# EAGLE design SterownikOswietlenia (EAGLE 7.6.0)
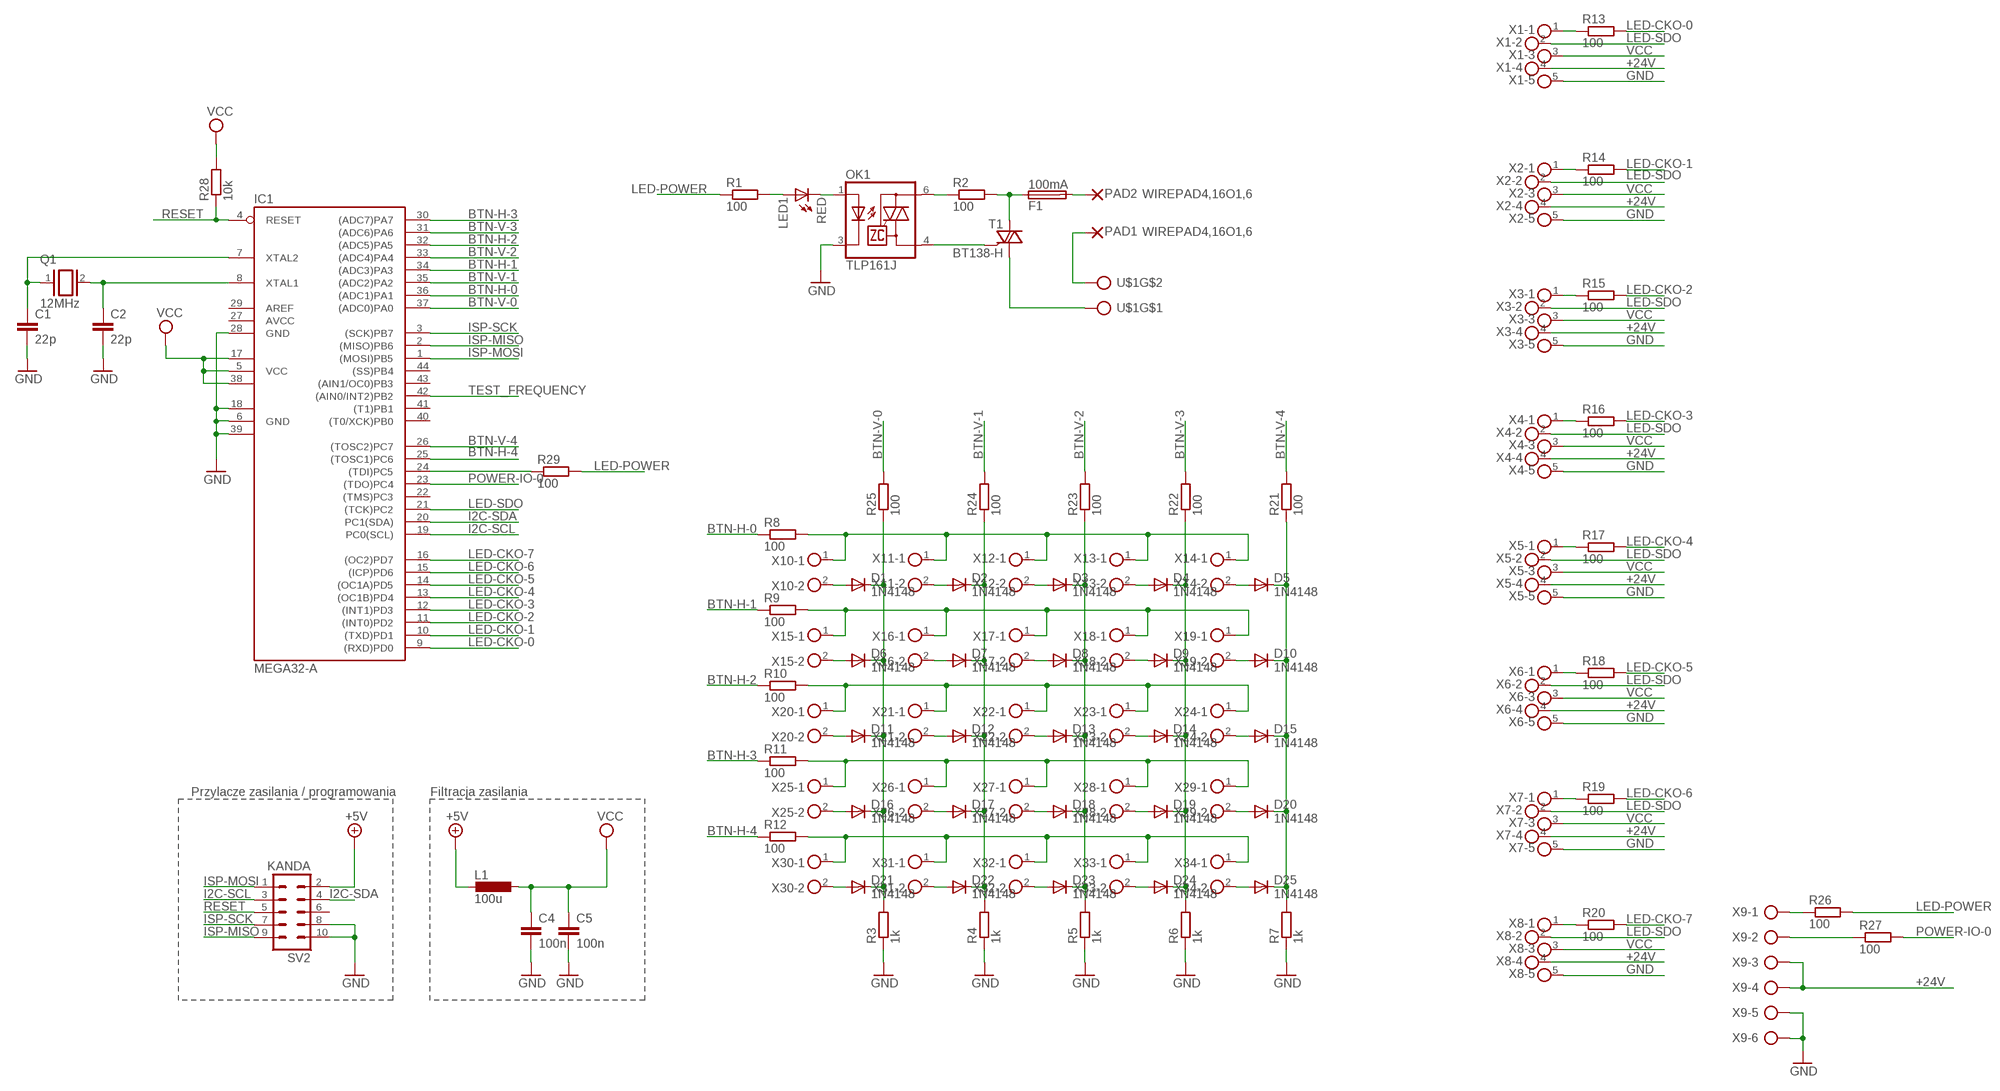
[diagram p0: schematic, sheet 1]

## Parts
C1  22p  C-EUC1206  [C1206]
C2  22p  C-EUC1206  [C1206]
C4  100n  C-EUC1206  [C1206]
C5  100n  C-EUC1206  [C1206]
D1  1N4148  DIODE-MINIMELF  [MINIMELF]
D2  1N4148  DIODE-MINIMELF  [MINIMELF]
D3  1N4148  DIODE-MINIMELF  [MINIMELF]
D4  1N4148  DIODE-MINIMELF  [MINIMELF]
D5  1N4148  DIODE-MINIMELF  [MINIMELF]
D6  1N4148  DIODE-MINIMELF  [MINIMELF]
D7  1N4148  DIODE-MINIMELF  [MINIMELF]
D8  1N4148  DIODE-MINIMELF  [MINIMELF]
D9  1N4148  DIODE-MINIMELF  [MINIMELF]
D10  1N4148  DIODE-MINIMELF  [MINIMELF]
D11  1N4148  DIODE-MINIMELF  [MINIMELF]
D12  1N4148  DIODE-MINIMELF  [MINIMELF]
D13  1N4148  DIODE-MINIMELF  [MINIMELF]
D14  1N4148  DIODE-MINIMELF  [MINIMELF]
D15  1N4148  DIODE-MINIMELF  [MINIMELF]
D16  1N4148  DIODE-MINIMELF  [MINIMELF]
D17  1N4148  DIODE-MINIMELF  [MINIMELF]
D18  1N4148  DIODE-MINIMELF  [MINIMELF]
D19  1N4148  DIODE-MINIMELF  [MINIMELF]
D20  1N4148  DIODE-MINIMELF  [MINIMELF]
D21  1N4148  DIODE-MINIMELF  [MINIMELF]
D22  1N4148  DIODE-MINIMELF  [MINIMELF]
D23  1N4148  DIODE-MINIMELF  [MINIMELF]
D24  1N4148  DIODE-MINIMELF  [MINIMELF]
D25  1N4148  DIODE-MINIMELF  [MINIMELF]
F1  100mA  F457  [F457]
IC1  MEGA32-A  [TQFP44]
L1  100u  L-EUL1210  [R1210]
LED1  RED  LED3MM  [LED3MM]
OK1  TLP161J  [MFP4]
PAD1  WIREPAD4,16O1,6  [4,16O1,6]
PAD2  WIREPAD4,16O1,6  [4,16O1,6]
Q1  12MHz  XTAL/S  [QS]
R1  100  R-EU_R1206  [R1206]
R2  100  R-EU_R1206  [R1206]
R3  1k  R-EU_R1206  [R1206]
R4  1k  R-EU_R1206  [R1206]
R5  1k  R-EU_R1206  [R1206]
R6  1k  R-EU_R1206  [R1206]
R7  1k  R-EU_R1206  [R1206]
R8  100  R-EU_R1206  [R1206]
R9  100  R-EU_R1206  [R1206]
R10  100  R-EU_R1206  [R1206]
R11  100  R-EU_R1206  [R1206]
R12  100  R-EU_R1206  [R1206]
R13  100  R-EU_R1206  [R1206]
R14  100  R-EU_R1206  [R1206]
R15  100  R-EU_R1206  [R1206]
R16  100  R-EU_R1206  [R1206]
R17  100  R-EU_R1206  [R1206]
R18  100  R-EU_R1206  [R1206]
R19  100  R-EU_R1206  [R1206]
R20  100  R-EU_R1206  [R1206]
R21  100  R-EU_R1206  [R1206]
R22  100  R-EU_R1206  [R1206]
R23  100  R-EU_R1206  [R1206]
R24  100  R-EU_R1206  [R1206]
R25  100  R-EU_R1206  [R1206]
R26  100  R-EU_R1206  [R1206]
R27  100  R-EU_R1206  [R1206]
R28  10k  R-EU_R1206  [R1206]
R29  100  R-EU_R1206  [R1206]
SV2  KANDA  ML10L  [ML10L]
T1  BT138-H  [TO220BH]
U$1  AK3001-2  [AK3001-2]
X1  AKL59-05  [5POL35]
X2  AKL59-05  [5POL35]
X3  AKL59-05  [5POL35]
X4  AKL59-05  [5POL35]
X5  AKL59-05  [5POL35]
X6  AKL59-05  [5POL35]
X7  AKL59-05  [5POL35]
X8  AKL59-05  [5POL35]
X9  AK500/6  [AK500/6]
X10  AKL59-02  [2POL35]
X11  AKL59-02  [2POL35]
X12  AKL59-02  [2POL35]
X13  AKL59-02  [2POL35]
X14  AKL59-02  [2POL35]
X15  AKL59-02  [2POL35]
X16  AKL59-02  [2POL35]
X17  AKL59-02  [2POL35]
X18  AKL59-02  [2POL35]
X19  AKL59-02  [2POL35]
X20  AKL59-02  [2POL35]
X21  AKL59-02  [2POL35]
X22  AKL59-02  [2POL35]
X23  AKL59-02  [2POL35]
X24  AKL59-02  [2POL35]
X25  AKL59-02  [2POL35]
X26  AKL59-02  [2POL35]
X27  AKL59-02  [2POL35]
X28  AKL59-02  [2POL35]
X29  AKL59-02  [2POL35]
X30  AKL59-02  [2POL35]
X31  AKL59-02  [2POL35]
X32  AKL59-02  [2POL35]
X33  AKL59-02  [2POL35]
X34  AKL59-02  [2POL35]

## Nets
+5V: L1.2 SV2.2
+24V: X1.4 X2.4 X3.4 X4.4 X5.4 X6.4 X7.4 X8.4 X9.3 X9.4
BTN-H-0: IC1.36((ADC1)PA1) R8.1
BTN-H-1: IC1.34((ADC3)PA3) R9.1
BTN-H-2: IC1.32((ADC5)PA5) R10.1
BTN-H-3: IC1.30((ADC7)PA7) R11.1
BTN-H-4: IC1.25((TOSC1)PC6) R12.1
BTN-V-0: IC1.37((ADC0)PA0) R25.2
BTN-V-1: IC1.35((ADC2)PA2) R24.2
BTN-V-2: IC1.33((ADC4)PA4) R23.2
BTN-V-3: IC1.31((ADC6)PA6) R22.2
BTN-V-4: IC1.26((TOSC2)PC7) R21.2
GND: C1.2 C2.2 C4.2 C5.2 IC1.6(GND) IC1.18(GND1) IC1.28(GND) IC1.39(GND2) OK1.3(C) R3.1 R4.1 R5.1 R6.1 R7.1 SV2.8 SV2.10 X1.5 X2.5 X3.5 X4.5 X5.5 X6.5 X7.5 X8.5 X9.5 X9.6
I2C-SCL: IC1.19(PC0(SCL)) SV2.3
I2C-SDA: IC1.20(PC1(SDA)) SV2.4
ISP-MISO: IC1.2((MISO)PB6) SV2.9
ISP-MOSI: IC1.1((MOSI)PB5) SV2.1
ISP-SCK: IC1.3((SCK)PB7) SV2.7
LED-CKO-0: IC1.9((RXD)PD0) R13.2
LED-CKO-1: IC1.10((TXD)PD1) R14.2
LED-CKO-2: IC1.11((INT0)PD2) R15.2
LED-CKO-3: IC1.12((INT1)PD3) R16.2
LED-CKO-4: IC1.13((OC1B)PD4) R17.2
LED-CKO-5: IC1.14((OC1A)PD5) R18.2
LED-CKO-6: IC1.15((ICP)PD6) R19.2
LED-CKO-7: IC1.16((OC2)PD7) R20.2
LED-POWER: R1.1 R26.2 R29.2
LED-SDO: IC1.21((TCK)PC2) X1.2 X2.2 X3.2 X4.2 X5.2 X6.2 X7.2 X8.2
M$44: R12.2 X30.1 X31.1 X32.1 X33.1 X34.1
N$1: PAD1.1(P) U$1.P$3 U$1.P$4
N$2: OK1.6(A2) R2.1
N$3: F1.1 R2.2 T1.T2(A2)
N$4: OK1.4(A1) T1.G
N$5: LED1.K(C) OK1.1(A)
N$6: LED1.A R1.2
N$7: R13.1 X1.1
N$8: T1.T1(A1) U$1.P$1 U$1.P$2
N$9: D1.A X10.2
N$10: D2.A X11.2
N$11: F1.2 PAD2.1(P)
N$12: D3.A X12.2
N$13: D4.A X13.2
N$14: R14.1 X2.1
N$15: R15.1 X3.1
N$16: R16.1 X4.1
N$17: R17.1 X5.1
N$18: D5.A X14.2
N$19: D10.A X19.2
N$20: D9.A X18.2
N$21: D8.A X17.2
N$22: D7.A X16.2
N$23: D6.A X15.2
N$24: D11.A X20.2
N$25: D12.A X21.2
N$26: D13.A X22.2
N$27: D14.A X23.2
N$28: D15.A X24.2
N$29: D20.A X29.2
N$30: D19.A X28.2
N$32: D17.A X26.2
N$33: D16.A X25.2
N$34: D21.A X30.2
N$35: D22.A X31.2
N$36: D23.A X32.2
N$37: D24.A X33.2
N$38: D25.A X34.2
N$39: R18.1 X6.1
N$40: R8.2 X10.1 X11.1 X12.1 X13.1 X14.1
N$41: R9.2 X15.1 X16.1 X17.1 X18.1 X19.1
N$42: R10.2 X20.1 X21.1 X22.1 X23.1 X24.1
N$43: R11.2 X25.1 X26.1 X27.1 X28.1 X29.1
N$44: R19.1 X7.1
N$45: R20.1 X8.1
N$46: C1.1 IC1.7(XTAL2) Q1.1
N$47: C2.1 IC1.8(XTAL1) Q1.2
N$49: R27.1 X9.2
N$50: R26.1 X9.1
N$51: IC1.24((TDI)PC5) R29.1
N$52: D18.A X27.2
N$113: D5.C D10.C D15.C D20.C D25.C R7.2 R21.1
N$131: D4.C D9.C D14.C D19.C D24.C R6.2 R22.1
N$132: D3.C D8.C D13.C D18.C D23.C R5.2 R23.1
N$133: D2.C D7.C D12.C D17.C D22.C R4.2 R24.1
N$134: D1.C D6.C D11.C D16.C D21.C R3.2 R25.1
POWER-IO-0: IC1.23((TDO)PC4) R27.2
RESET: IC1.4(RESET) R28.1 SV2.5
TEST_FREQUENCY: IC1.42((AIN0/INT2)PB2)
VCC: C4.1 C5.1 IC1.5(VCC) IC1.17(VCC1) IC1.38(VCC2) L1.1 R28.2 X1.3 X2.3 X3.3 X4.3 X5.3 X6.3 X7.3 X8.3
Unconnected: IC1.22((TMS)PC3) IC1.29(AREF) IC1.40((T0/XCK)PB0) IC1.41((T1)PB1) IC1.43((AIN1/OC0)PB3) IC1.44((SS)PB4) SV2.6

## Notes on the sheet
- Przylacze zasilania / programowania | Filtracja zasilania

## Power pins joined to a net without a drawn wire
AVCC: IC1.27(AVCC)

## Library data of the parts
C1 C2 C4 C5 = rcl:C-EU: CAPACITOR, European symbol
D1-D25 = diode:DIODE-: DIODE
F1 = fuse:F457: FUSE HOLDER CS, Schukat; OC_FARNELL: unknown; OC_NEWARK: unknown
IC1 = atmel:MEGA32: MICROCONTROLLER 32 Kbytes FLASH 2 Kbytes SRAM 1 Kbytes EEPROM USART 8-channel 10 bit ADC Source: www.atmel.com .. doc2503.pdf; MPN: ATMEGA32-16AU; OC_FARNELL: 9171274; OC_NEWARK: 69K6677
L1 = rcl:L-EU: INDUCTOR, European symbol
LED1 = led:LED: LED OSRAM: - CHIPLED LG R971, LG N971, LY N971, LG Q971, LY Q971, LO R971, LY R971 LH N974, LH R974 LS Q976, LO Q976, LY Q976 LO Q996 - Hyper CHIPLED LW Q18S LB Q993, LB Q99A, LB R99A - SideLED LS A670, LO A670, LY A670, LG A670, LP A670 LB A673, LV A673, LT A673, LW A673 LH A674 LY A675 LS A676, LA A676, LO A676, LY A676, LW A676 LS A679, LY A679, LG A679 - Hyper Micro SIDELED® LS Y876, LA Y876, LO Y876, LY Y876 LT Y87S - SmartLED LW L88C, LW L88S LB L89C, LB L89S, LG L890 LS L89K, LO L89K, LY L89K LS L896, LA L896, LO L896, LY L896 - TOPLED LS T670, LO T670, LY T670, LG T670, LP T670 LSG T670, LSP T670, LSY T670, LOP T670, LYG T670 LG T671, LOG T671, LSG T671 LB T673, LV T673, LT T673, LW T673 LH T674 LS T676, LA T676, LO T676, LY T676, LB T676, LH T676, LSB T676, LW T676 LB T67C, LV T67C, LT T67C, LS T67K, LO T67K, LY T67K, LW E67C LS E67B, LA E67B, LO E67B, LY E67B, LB E67C, LV E67C, LT E67C LW T67C LS T679, LY T679, LG T679 LS T770, LO T770, LY T770, LG T770, LP T770 LB T773, LV T773, LT T773, LW T773 LH T774 LS E675, LA E675, LY E675, LS T675 LS T776, LA T776, LO T776, LY T776, LB T776 LHGB T686 LT T68C, LB T68C - Hyper Mini TOPLED® LB M676 - Mini TOPLED Santana® LG M470 LS M47K, LO M47K, LY M47K Source: http://www.osram.convergy.de LUXEON: - LUMILED® LXK2-PW12-R00, LXK2-PW12-S00, LXK2-PW14-U00, LXK2-PW14-V00 LXK2-PM12-R00, LXK2-PM12-S00, LXK2-PM14-U00 LXK2-PE12-Q00, LXK2-PE12-R00, LXK2-PE12-S00, LXK2-PE14-T00, LXK2-PE14-U00 LXK2-PB12-K00, LXK2-PB12-L00, LXK2-PB12-M00, LXK2-PB14-N00, LXK2-PB14-P00, LXK2-PB14-Q00 LXK2-PR12-L00, LXK2-PR12-M00, LXK2-PR14-Q00, LXK2-PR14-R00 LXK2-PD12-Q00, LXK2-PD12-R00, LXK2-PD12-S00 LXK2-PH12-R00, LXK2-PH12-S00 LXK2-PL12-P00, LXK2-PL12-Q00, LXK2-PL12-R00 Source: www.luxeon.com KINGBRIGHT: KA-3528ASYC Source: www.kingbright.com
OK1 = RD:TLP161J: Optotriak SMD 2.5kV 600V 10mA MFP4 przełączanie w zerze PBF Source: http://mselektronik.pl/attchmentdownload/download/download/?d=0&file=custom%2Fupload%2FFile-1350758070.pdf
PAD1 PAD2 = wirepad:WIREPAD: Wire PAD connect wire on PCB
Q1 = special:XTAL/S: CRYSTAL
R1-R29 = rcl:R-EU_: RESISTOR, European symbol
SV2 = con-harting-ml:ML10: HARTING; OC_FARNELL: unknown; OC_NEWARK: unknown
T1 = triac:BT138: TRIAC Source: http://www.semiconductors.philips.com BT138_SERIES_2.pdf
U$1 = RD:AK3001-2
X1-X8 = con-ria-59:AKL59-05: RIA Anschlussklemme Typ 59, Raster 3,5 mm, Polzahl 5
X9 = con-ptr500:AK500/6: CONNECTOR; OC_FARNELL: unknown; OC_NEWARK: unknown
X10-X34 = con-ria-59:AKL59-02: RIA Anschlussklemme Typ 59, Raster 3,5 mm, Polzahl 2

## Net classes
0 default: clearance 0.355 mm

## Board
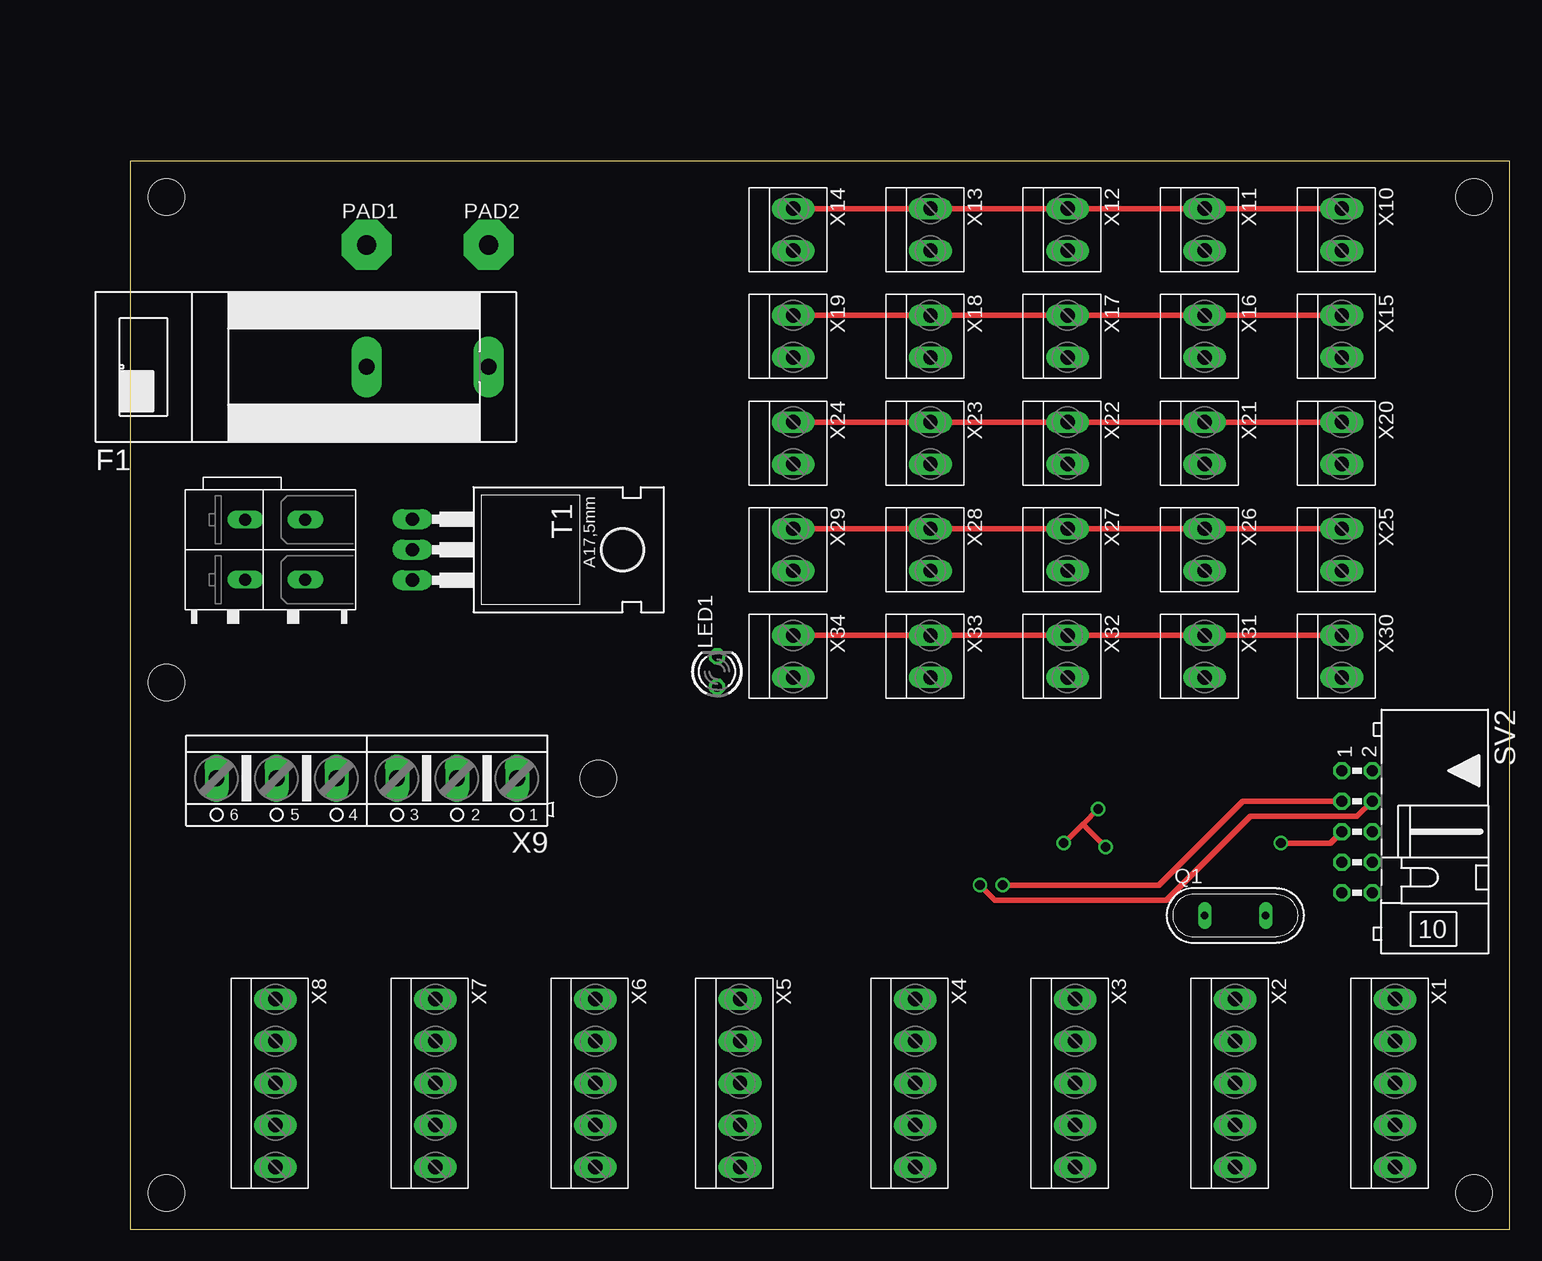
[diagram p1: board, top side]
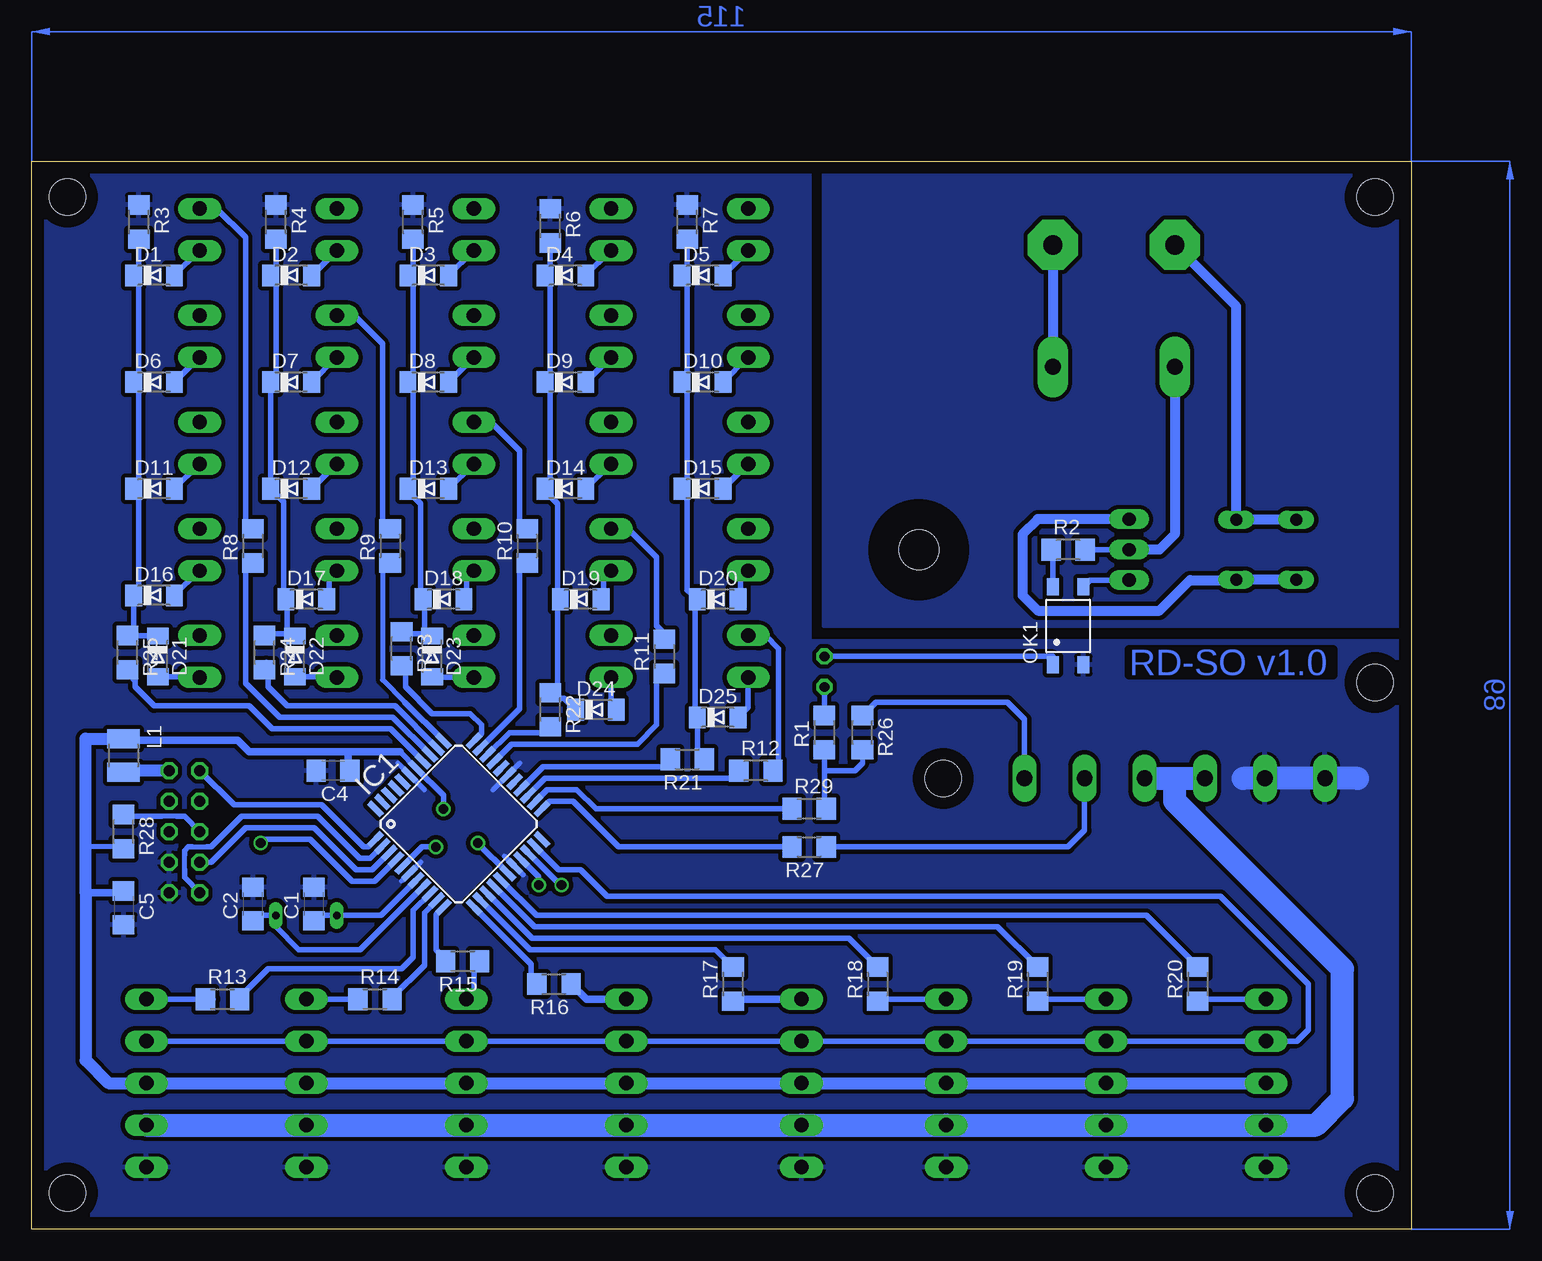
[diagram p2: board, bottom side, seen from below]

Size 115 x 89 mm. Coordinates in mm from the lower left corner, seen from the top.
Outline: 0,0 115,0 115,89 0,89 0,0
Copper layers (1*16): Top 0.035mm / dielectric 1.5mm / Bottom 0.035mm
Design rules "default *": minimum track width 10mil, minimum drill 24mil, track to track 8mil, track to pad 8mil, pad to pad 8mil, via to via 8mil, smd to smd 8mil, copper to edge 40mil, drill to drill 8mil, minimum pad ring 10mil, minimum via ring 8mil, stop-mask expansion 4mil, vias tented up to drill 0mil, thermal gap 10mil
Holes 3 mm at 3,3 3,86 112,86 112,3 3,45.54 39,37.54

### Footprints (pad centres in the part's own frame; a part is rotated, then mirrored left to right if it is on the bottom)
C1206 = smd 1.6 x 1.8: 1 -1.4,0; 2 1.4,0
MINIMELF = smd 1.4 x 1.8: A 1.7,0; C -1.7,0
F457 = drill 1.321 pad 2.54 long: 1 -5.08,0; 2 5.08,0
TQFP44 = smd 1.5 x 0.5: 1 -5.8,4; 2 -5.8,3.2; 3 -5.8,2.4; 4 -5.8,1.6; 5 -5.8,0.8; 6 -5.8,0; 7 -5.8,-0.8; 8 -5.8,-1.6; 9 -5.8,-2.4; 10 -5.8,-3.2; 11 -5.8,-4; 23 5.8,-4; 24 5.8,-3.2; 25 5.8,-2.4; 26 5.8,-1.6; 27 5.8,-0.8; 28 5.8,0; 29 5.8,0.8; 30 5.8,1.6; 31 5.8,2.4; 32 5.8,3.2; 33 5.8,4 | smd 0.5 x 1.5: 12 -4,-5.8; 13 -3.2,-5.8; 14 -2.4,-5.8; 15 -1.6,-5.8; 16 -0.8,-5.8; 17 0,-5.8; 18 0.8,-5.8; 19 1.6,-5.8; 20 2.4,-5.8; 21 3.2,-5.8; 22 4,-5.8; 34 4,5.8; 35 3.2,5.8; 36 2.4,5.8; 37 1.6,5.8; 38 0.8,5.8; 39 0,5.8; 40 -0.8,5.8; 41 -1.6,5.8; 42 -2.4,5.8; 43 -3.2,5.8; 44 -4,5.8
R1210 = smd 1.6 x 2.7: 1 -1.4,0; 2 1.4,0
LED3MM = drill 0.813 octagon: A -1.27,0; K 1.27,0
MFP4 = smd 1.016 x 1.422: 1 -1.27,-3.25; 3 1.27,-3.25; 4 1.27,3.25; 6 -1.27,3.25
4,16O1,6 = drill 1.6 pad 4.166 octagon: 1 0,0
QS = drill 0.61 long: 1 -2.54,0; 2 2.54,0
R1206 = smd 1.6 x 1.803: 1 -1.422,0; 2 1.422,0
ML10L = drill 0.914 octagon: 1 -5.08,-1.27; 2 -5.08,1.27; 3 -2.54,-1.27; 4 -2.54,1.27; 5 0,-1.27; 6 0,1.27; 7 2.54,-1.27; 8 2.54,1.27; 9 5.08,-1.27; 10 5.08,1.27
TO220BH = drill 1.118 long: G 2.54,-6.35; T1 -2.54,-6.35; T2 0,-6.35 | hole 3.302: 0,11.176
AK3001-2 = drill 1 long: P$1 -2.5,2.5; P$2 -2.5,-2.5; P$3 2.5,2.5; P$4 2.5,-2.5
5POL35 = drill 1.2 long: 1 -7,0; 2 -3.5,0; 3 0,0; 4 3.5,0; 5 7,0
AK500/6 = drill 1.321 long: 1 -12.522,0; 2 -7.518,0; 3 -2.515,0; 4 2.515,0; 5 7.518,0; 6 12.522,0
2POL35 = drill 1.2 long: 1 -1.75,0; 2 1.75,0

### Placement (x,y rotation side)
C1  91.45,27.08 90 bottom
C2  96.53,27.08 90 bottom
C4  89.87,38.2 180 bottom
C5  107.33,26.77 270 bottom
D1  104.79,79.47 0 bottom
D2  93.36,79.47 0 bottom
D3  81.93,79.47 0 bottom
D4  70.5,79.47 0 bottom
D5  59.07,79.47 0 bottom
D6  104.79,70.58 0 bottom
D7  93.36,70.58 0 bottom
D8  81.93,70.58 0 bottom
D9  70.5,70.58 0 bottom
D10  59.07,70.58 0 bottom
D11  104.79,61.69 0 bottom
D12  93.36,61.69 0 bottom
D13  81.93,61.69 0 bottom
D14  70.5,61.69 0 bottom
D15  59.07,61.69 0 bottom
D16  104.79,52.8 0 bottom
D17  92.09,52.48 0 bottom
D18  80.66,52.48 0 bottom
D19  69.23,52.48 0 bottom
D20  57.8,52.48 0 bottom
D21  104.47,47.72 270 bottom
D22  93.04,47.72 270 bottom
D23  81.61,47.72 270 bottom
D24  67.96,43.27 0 bottom
D25  57.8,42.64 0 bottom
F1  24.78,71.85 0 top
IC1  79.39,33.75 45 bottom
L1  107.33,39.46 270 bottom
LED1  48.91,46.45 90 top
OK1  28.59,50.26 0 bottom
PAD1  19.7,82.01 0 top
PAD2  29.86,82.01 0 top
Q1  92.09,26.13 0 top
R1  48.91,41.37 90 bottom
R2  28.59,56.61 0 bottom
R3  106.06,83.92 270 bottom
R4  94.63,83.92 270 bottom
R5  83.2,83.92 270 bottom
R6  71.77,83.6 270 bottom
R7  60.34,83.92 270 bottom
R8  96.53,56.93 90 bottom
R9  85.11,56.93 90 bottom
R10  73.67,56.93 90 bottom
R11  62.24,47.72 90 bottom
R12  54.62,38.2 0 bottom
R13  99.08,19.14 0 bottom
R14  86.38,19.14 0 bottom
R15  79.07,22.32 180 bottom
R16  71.45,20.41 180 bottom
R17  56.53,20.41 90 bottom
R18  44.47,20.41 90 bottom
R19  31.13,20.41 90 bottom
R20  17.8,20.41 90 bottom
R21  60.34,39.15 180 bottom
R22  71.77,43.27 270 bottom
R23  84.15,48.35 270 bottom
R24  95.58,48.04 270 bottom
R25  107.01,48.04 270 bottom
R26  45.73,41.37 270 bottom
R27  50.18,31.84 180 bottom
R28  107.33,33.12 270 bottom
R29  50.18,35.02 0 bottom
SV2  102.25,33.12 270 top
T1  29.86,56.61 270 top
U$1  12.08,56.61 90 top
X1  105.42,12.16 270 top
X2  92.09,12.16 270 top
X3  78.75,12.16 270 top
X4  65.42,12.16 270 top
X5  50.81,12.16 270 top
X6  38.75,12.16 270 top
X7  25.41,12.16 270 top
X8  12.08,12.16 270 top
X9  19.7,37.56 180 top
X10  100.98,83.28 270 top
X11  89.55,83.28 270 top
X12  78.12,83.28 270 top
X13  66.69,83.28 270 top
X14  55.26,83.28 270 top
X15  100.98,74.39 270 top
X16  89.55,74.39 270 top
X17  78.12,74.39 270 top
X18  66.69,74.39 270 top
X19  55.26,74.39 270 top
X20  100.98,65.5 270 top
X21  89.55,65.5 270 top
X22  78.12,65.5 270 top
X23  66.69,65.5 270 top
X24  55.26,65.5 270 top
X25  100.98,56.61 270 top
X26  89.55,56.61 270 top
X27  78.12,56.61 270 top
X28  66.69,56.61 270 top
X29  55.26,56.61 270 top
X30  100.98,47.72 270 top
X31  89.55,47.72 270 top
X32  78.12,47.72 270 top
X33  66.69,47.72 270 top
X34  55.26,47.72 270 top

### Tracks (layer width: path | path; a pad name or v marks a point on that pad's centre or on a via)
+5V
  Bottom 0.61: 107.2,38.2 L1.2
  Bottom 1.016: SV2.2 107.2,38.2
+24V
  Bottom 1.93: X1.4 X2.4 X3.4 X4.4 X5.4 X6.4 X7.4 X8.4 7.96,8.66 5.73,10.89 5.73,21.68 19.7,35.66 19.7,37.56 | X9.3 19.7,37.56 | 19.7,37.56 X9.4
BTN-H-0
  Bottom 0.406: R8.1 97.02,55.02 97.17,55.02
  Bottom 0.457: IC1.36 84.89,42.64 94.31,42.64 97.17,45.5 97.17,55.02
BTN-H-1
  Bottom 0.406: 85.74,55.34 85.74,45.76 83.89,43.91
  Bottom 0.457: IC1.34 83.89,43.91 | 85.74,55.34 85.58,55.51 R9.1
BTN-H-2
  Bottom 0.457: IC1.32 74.31,43.35 74.31,55.34 73.83,55.82 R10.1
BTN-H-3
  Bottom 0.457: IC1.30 74.98,40.42 64.47,40.42 62.88,42.01 62.88,46.45 62.73,46.45 R11.1
BTN-H-4
  Bottom 0.457: IC1.25 72.19,37.56 56.53,37.56 56.53,37.71 R12.1
BTN-V-0
  Bottom 0.406: R25.2 106.53,45.81 106.38,45.81
  Bottom 0.457: IC1.37 85.06,41.69 94.95,41.69 96.85,43.59 104.79,43.59 106.38,45.18 106.38,45.81
BTN-V-1
  Bottom 0.406: R24.2 95.43,47.25 95.27,47.09
  Bottom 0.457: IC1.35 84.71,43.59 93.68,43.59 95.27,45.18 95.27,47.09
BTN-V-2
  Bottom 0.457: R23.2 83.83,47.25 83.83,45.18 81.61,42.96 78.44,42.96 77.48,42.01 77.48,41.31 IC1.33
BTN-V-3
  Bottom 0.457: IC1.31 75.16,41.37 72.09,41.37 71.77,41.69 R22.2
BTN-V-4
  Bottom 0.457: IC1.26 72.36,38.51 62.4,38.51 R21.2
GND
  Bottom 0.406: 84.15,28.99 IC1.6 82.56,30.57 | 82.25,36.61 IC1.39 84.15,38.51 84.47,38.83 | 73.99,29.48 IC1.18 75.58,31.07 | 74.31,38.83 IC1.28 76.53,36.61
  Bottom 1.93: 4.46,37.56 13.98,37.56
  pour Bottom: -0.62,48.99 -1.54,-1.81 117.49,-1.81 114.95,89.63 50.18,89.63 50.18,48.99
I2C-SCL  (via drill 0.8)
  Top 0.457: v72.72,28.67 85.74,28.67 92.72,35.66 SV2.3
  Bottom 0.457: IC1.19 72.72,29.34 v72.72,28.67
I2C-SDA  (via drill 0.8)
  Top 0.406: 72.09,27.4 v70.82,28.67
  Top 0.457: 72.09,27.4 86.38,27.4 93.36,34.38 102.25,34.38 SV2.4
  Bottom 0.406: 70.82,28.57 v70.82,28.67
  Bottom 0.457: IC1.20 70.82,28.57
ISP-MISO
  Bottom 0.406: 102.25,29.94 102.25,31.21 | 101.61,31.84 100.34,31.84
  Bottom 0.457: IC1.2 86.77,30.89 87.64,30.89 91.14,34.38 97.49,34.38 100.03,31.84 100.34,31.84 | SV2.9 102.25,29.3 102.25,29.94 | 102.25,31.21 102.25,31.53 101.93,31.84 101.61,31.84
ISP-MOSI
  Bottom 0.457: SV2.1 98.12,35.34 90.82,35.34 87.33,31.84 86.95,31.84 IC1.1
ISP-SCK
  Bottom 0.457: IC1.3 86.59,29.94 87.96,29.94 91.45,33.43 97.17,33.43 100.03,30.57 SV2.7
LED-CKO-0
  Bottom 0.457: R13.2 97.02,19.93 95.27,21.68 84.15,21.68 83.2,22.64 83.2,26.55 IC1.9
LED-CKO-1
  Bottom 0.457: R14.2 84.95,19.3 82.25,22 82.25,26.37 IC1.10
LED-CKO-2
  Bottom 0.457: IC1.11 81.3,26.19 81.3,23.27 80.5,22.48 R15.2
LED-CKO-3
  Bottom 0.457: IC1.12 73.36,22.06 73.36,20.73 73.04,20.41 R16.2
LED-CKO-4
  Bottom 0.457: IC1.13 73.44,23.27 57.97,23.27 R17.2
LED-CKO-5
  Bottom 0.457: IC1.14 73.26,24.22 46.85,24.22 R18.2
LED-CKO-6
  Bottom 0.457: IC1.15 73.08,25.18 34.47,25.18 R19.2
LED-CKO-7
  Bottom 0.457: IC1.16 72.9,26.13 22.09,26.13 R20.2
LED-POWER
  Bottom 0.406: R26.2 45.73,38.83 | 48.91,35.17 R29.2
  Bottom 0.457: 48.91,38.2 46.37,38.2 45.73,38.83 | R1.1 48.91,38.2 | 48.91,38.2 48.91,35.17
LED-SDO
  Bottom 0.457: IC1.21 71.06,29.94 69.23,29.94 67.01,27.72 15.89,27.72 8.59,20.41 8.59,16.61 9.53,15.66 X8.2 X7.2 X6.2 X5.2 X4.2 X3.2 X2.2 X1.2
M$44
  Top 0.457: X30.1 X31.1 X32.1 X33.1 X34.1
  Bottom 0.457: R12.2 52.72,39 52.72,48.35 53.84,49.47 X34.1
N$1
  Bottom 0.813: U$1.P$3 U$1.P$4 14.58,76.89 PAD1.1
N$2
  Bottom 0.406: 29.86,56.46 R2.1
  Bottom 0.457: OK1.6 29.86,56.46
N$3
  Bottom 0.457: R2.2 T1.T2
  Bottom 0.813: F1.1 19.7,57.88 20.97,56.61 T1.T2
N$4
  Bottom 0.457: T1.G 26.76,54.07 OK1.4
N$5
  Bottom 0.457: OK1.1 29.86,47.72 LED1.K
N$6
  Bottom 0.457: R1.2 LED1.A
N$7
  Bottom 0.457: X1.1 99.85,19.16 R13.1
N$8
  Bottom 0.813: T1.T1 31.13,59.15 32.4,57.88 32.4,52.8 31.13,51.53 20.97,51.53 18.43,54.07 14.62,54.07 U$1.P$2 U$1.P$1
N$9
  Bottom 0.457: D1.A 101.03,81.53 X10.2
N$10
  Bottom 0.457: D2.A 91.61,79.47 X11.2
N$11
  Bottom 0.813: PAD2.1 F1.2
N$12
  Bottom 0.457: D3.A 78.17,81.53 X12.2
N$13
  Bottom 0.457: D4.A 66.74,81.53 X13.2
N$14
  Bottom 0.457: X2.1 87.81,19.16 R14.1
N$15
  Bottom 0.457: X3.1 78.12,19.78 78.12,21.85 R15.1
N$16
  Bottom 0.61: X4.1 68.75,19.16 R16.1
N$17
  Bottom 0.61: X5.1 56.36,19.16 R17.1
N$18
  Bottom 0.457: D5.A 55.31,81.53 X14.2
N$19
  Bottom 0.457: D10.A 55.31,72.64 X19.2
N$20
  Bottom 0.457: D9.A 66.74,72.64 X18.2
N$21
  Bottom 0.457: D8.A 78.17,72.64 X17.2
N$22
  Bottom 0.457: D7.A 89.6,72.64 X16.2
N$23
  Bottom 0.457: D6.A 101.03,72.64 X15.2
N$24
  Bottom 0.457: D11.A 101.03,63.75 X20.2
N$25
  Bottom 0.457: D12.A 89.6,63.75 X21.2
N$26
  Bottom 0.457: D13.A 78.17,63.75 X22.2
N$27
  Bottom 0.457: D14.A 66.74,63.75 X23.2
N$28
  Bottom 0.457: D15.A 55.31,63.75 X24.2
N$29
  Bottom 0.457: D20.A 55.9,52.69 55.9,54.23 X29.2
N$30
  Bottom 0.457: X28.2 67.33,54.23 67.33,52.69 D19.A
N$32
  Bottom 0.457: X26.2 89.71,54.86 90.19,54.39 90.19,52.69 D17.A
N$33
  Bottom 0.457: D16.A 101.03,54.86 X25.2
N$34
  Bottom 0.406: 101.03,46.02 X30.2
  Bottom 0.457: D21.A 101.03,46.02
N$35
  Bottom 0.406: 89.6,46.02 X31.2
  Bottom 0.457: D22.A 89.6,46.02
N$36
  Bottom 0.457: D23.A 81.88,45.97 X32.2
N$37
  Bottom 0.457: X33.2 66.69,43.07 D24.A
N$38
  Bottom 0.457: D25.A 55.26,43.48 X34.2
N$39
  Bottom 0.457: X6.1 44.3,19.16 R18.1
N$40
  Top 0.457: X14.1 X13.1 X12.1 X11.1 X10.1
  Bottom 0.406: R8.2 97.02,58.83 97.17,58.83
  Bottom 0.457: 97.17,58.83 97.17,82.65 99.56,85.03 X10.1
N$41
  Top 0.457: X19.1 X18.1 X17.1 X16.1 X15.1
  Bottom 0.457: R9.2 85.74,58.98 85.74,73.76 88.12,76.14 X16.1
N$42
  Top 0.457: X24.1 X23.1 X22.1 X21.1 X20.1
  Bottom 0.457: R10.2 74.16,58.83 74.31,58.83 74.31,64.87 76.69,67.25 X22.1
N$43
  Top 0.457: X25.1 X26.1 X27.1 X28.1 X29.1
  Bottom 0.457: X28.1 65.27,58.36 62.88,55.98 62.88,50.26 62.4,49.78 R11.2
N$44
  Bottom 0.457: X7.1 30.96,19.16 R19.1
N$45
  Bottom 0.457: X8.1 17.63,19.16 R20.1
N$46
  Bottom 0.457: C1.1 91.33,26.13 Q1.1 85.88,26.13 IC1.7
N$47
  Bottom 0.457: IC1.8 87.61,23.27 92.72,23.27 94.63,25.18 Q1.2 96.41,26.13 C2.1
N$48
  pour Bottom: -0.62,88.36 -0.62,50.26 48.91,50.26 48.91,88.36
N$49
  Bottom 0.457: R27.1 28.59,31.84 27.22,33.22 X9.2
N$50
  Bottom 0.457: R26.1 44.62,43.91 33.67,43.91 32.22,42.46 X9.1
N$51
  Bottom 0.457: IC1.24 72.01,36.61 69.55,36.61 67.96,35.02 R29.1
N$52
  Bottom 0.457: X27.2 78.75,54.23 78.75,52.69 D18.A
N$113
  Bottom 0.457: R21.1 59.5,39.73 D25.C 59.7,42.84 59.7,52.28 D20.C 60.34,53.23 60.34,61.26 D15.C 60.34,62.12 60.34,70.15 D10.C 60.34,71.01 60.34,79.04 D5.C 60.34,79.9 R7.2
N$131
  Bottom 0.457: R6.2 71.77,79.9 D4.C 71.77,79.04 71.77,71.01 D9.C 71.77,70.15 71.77,62.12 D14.C 72.2,61.48 71.14,60.42 71.14,52.69 D19.C 71.14,52.28 71.14,45.33 R22.1 71.77,44.23 70.61,44.23 D24.C
N$132
  Bottom 0.457: R5.2 83.2,79.9 D3.C 83.2,79.04 83.2,71.01 D8.C 83.2,70.15 83.2,62.12 D13.C 83.2,61.26 83.2,61.05 82.56,60.42 82.56,52.69 D18.C 82.25,52.37 82.25,49.62 | R23.1 83.67,49.62 82.25,49.62 | D23.C 81.82,49.62 82.25,49.62
N$133
  Bottom 0.457: R4.2 94.63,79.9 D2.C 94.63,79.04 94.63,71.01 D7.C D12.C 94,60.62 94,52.69 D17.C 93.68,52.37 93.68,49.62 | R24.1 95.1,49.62 93.68,49.62 | D22.C 93.25,49.62 93.68,49.62
N$134
  Bottom 0.406: 106.73,49.42 R25.1 106.49,49.66
  Bottom 0.457: D1.C 106.06,79.04 | 106.06,79.04 106.06,71.01 D6.C 106.06,70.15 106.06,62.12 D11.C 106.06,61.26 106.06,53.23 D16.C 106.49,49.66 | 106.06,79.04 R3.2 | D21.C 106.73,49.42
POWER-IO-0
  Bottom 0.457: R27.2 66.06,31.84 69.87,35.66 71.83,35.66 IC1.23
RESET  (via drill 0.8)
  Top 0.457: SV2.5 100.03,32.16 v95.9,32.16
  Bottom 0.406: 102.89,34.38 104.16,34.38 | 107.33,34.38 R28.1
  Bottom 0.457: IC1.4 86.42,28.99 88.28,28.99 91.77,32.48 95.58,32.48 v95.9,32.16 | SV2.5 102.25,34.38 102.89,34.38 | 104.16,34.38 107.33,34.38
VCC  (via drill 0.8)
  Top 0.406: v80.66,35.02 79.39,33.75 | 79.39,33.75 v77.8,32.16 | v77.8,32.16 | v81.3,31.84 79.39,33.75
  Bottom 0.406: 106.38,40.73 107.33,41.05 L1.1 | C4.1 88.6,38.64 | R28.2 107.97,31.69 107.97,31.84 110.5,31.84 | v77.8,32.16
  Bottom 0.457: 84.29,39.78 IC1.38 80.66,36.15 v80.66,35.02 | IC1.17 v77.8,32.16 | IC1.5 82.43,31.84 v81.3,31.84
  Bottom 0.61: 84.29,39.78 88.6,39.78 | 88.6,39.78 96.85,39.78 97.81,40.73 106.38,40.73 | 88.6,38.64 88.6,39.78 | C5.1 107.33,28.04 110.5,28.04
  Bottom 1.016: L1.1 110.5,40.87 110.5,31.84 110.5,28.04 110.5,14.07 108.6,12.16 X1.3 X2.3 X3.3 X4.3 X5.3 X6.3 X7.3 X8.3
(copper drawn outside any net)
  shapes: Bottom area x2

### Text on the board
Bottom: RD-SO v1.0